# EAGLE design AbbotCameraController (EAGLE 6.5.0)
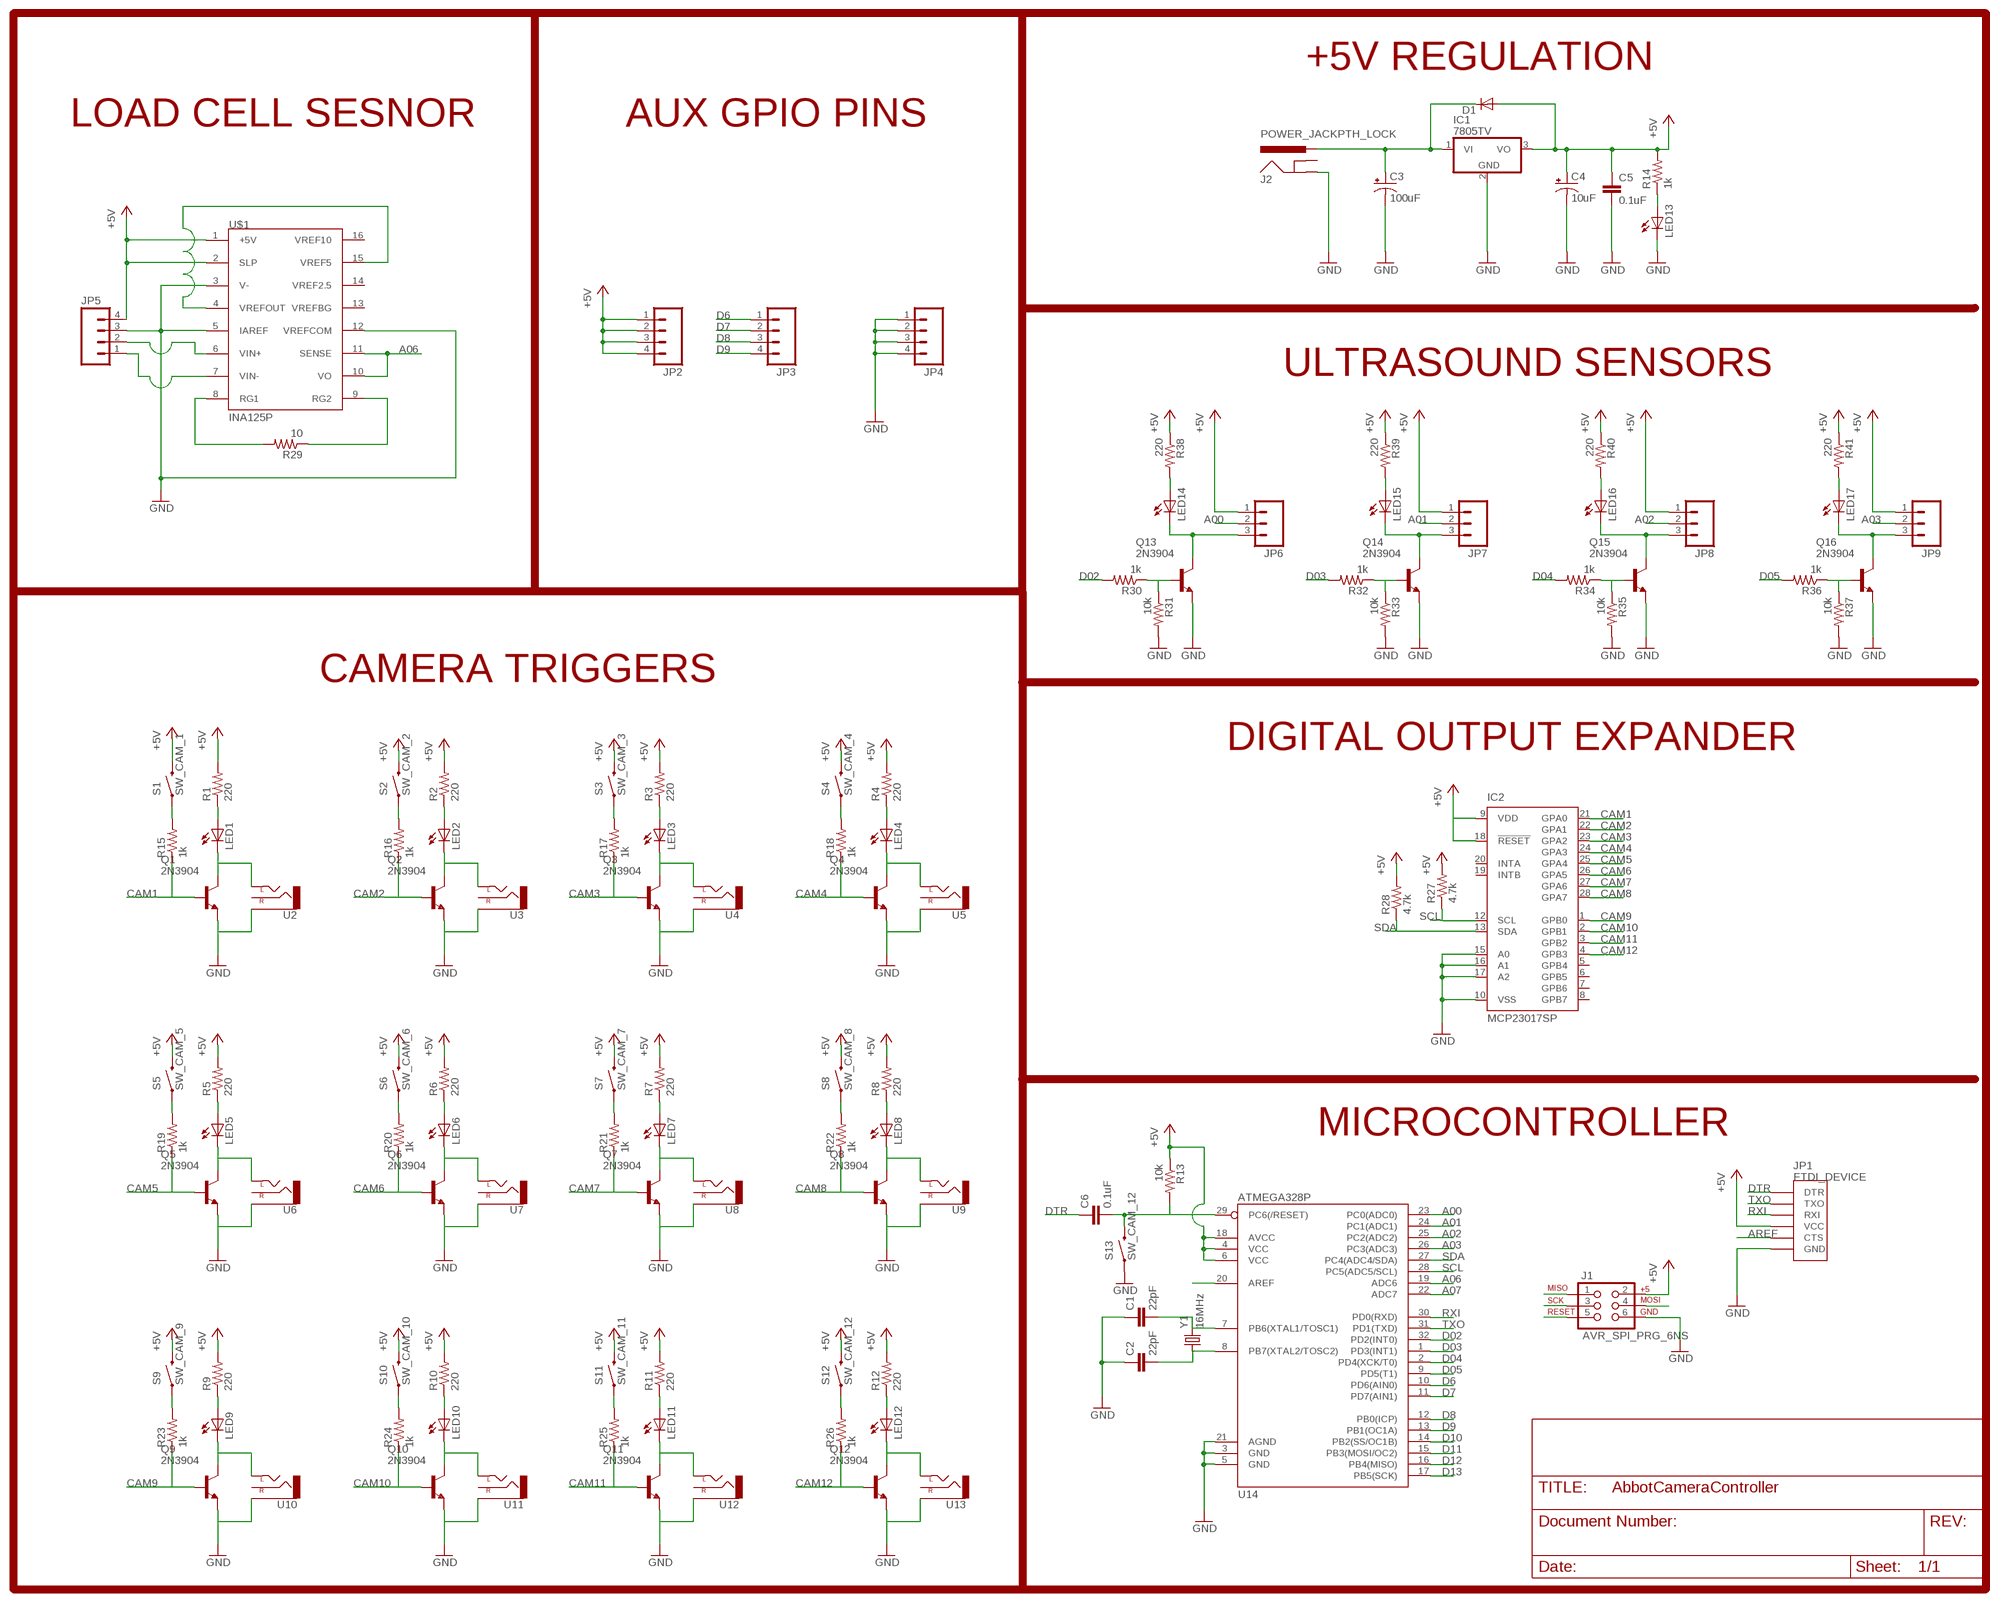
[diagram p0: schematic, sheet 1]

## Parts
C1  22pF  CAPPTH2  [CAP-PTH-SMALL2]
C2  22pF  CAPPTH2  [CAP-PTH-SMALL2]
C3  100uF  CPOL-USE2.5-7  [E2,5-7]
C4  10uF  CPOL-USE2.5-5  [E2,5-5]
C5  0.1uF  C-EU025-025X050  [C025-025X050]
C6  0.1uF  C-EU025-025X050  [C025-025X050]
D1  DIODEPTH  [DIODE-1N4001]
IC1  7805TV  [TO220V]
IC2  MCP23017SP  [DIL28-3]
J1  AVR_SPI_PRG_6NS  [2X3-NS]
J2  POWER_JACKPTH_LOCK  [POWER_JACK_PTH_LOCK]
JP1  FTDI_DEVICE  [FTDI_DEVICE_SIDE]
JP2  M04PTH  [1X04]
JP3  M04PTH  [1X04]
JP4  M04PTH  [1X04]
JP5  M04LONGPADS  [1X04_LONGPADS]
JP6  M03LONGPADS  [1X03_LONGPADS]
JP7  M03LONGPADS  [1X03_LONGPADS]
JP8  M03LONGPADS  [1X03_LONGPADS]
JP9  M03LONGPADS  [1X03_LONGPADS]
LED1  LED5MM  [LED5MM]
LED2  LED5MM  [LED5MM]
LED3  LED5MM  [LED5MM]
LED4  LED5MM  [LED5MM]
LED5  LED5MM  [LED5MM]
LED6  LED5MM  [LED5MM]
LED7  LED5MM  [LED5MM]
LED8  LED5MM  [LED5MM]
LED9  LED5MM  [LED5MM]
LED10  LED5MM  [LED5MM]
LED11  LED5MM  [LED5MM]
LED12  LED5MM  [LED5MM]
LED13  LED5MM  [LED5MM]
LED14  LED5MM  [LED5MM]
LED15  LED5MM  [LED5MM]
LED16  LED5MM  [LED5MM]
LED17  LED5MM  [LED5MM]
Q1  2N3904  [TO92]
Q2  2N3904  [TO92]
Q3  2N3904  [TO92]
Q4  2N3904  [TO92]
Q5  2N3904  [TO92]
Q6  2N3904  [TO92]
Q7  2N3904  [TO92]
Q8  2N3904  [TO92]
Q9  2N3904  [TO92]
Q10  2N3904  [TO92]
Q11  2N3904  [TO92]
Q12  2N3904  [TO92]
Q13  2N3904  [TO92]
Q14  2N3904  [TO92]
Q15  2N3904  [TO92]
Q16  2N3904  [TO92]
R1  220  R-US_0207/10  [0207/10]
R2  220  R-US_0207/10  [0207/10]
R3  220  R-US_0207/10  [0207/10]
R4  220  R-US_0207/10  [0207/10]
R5  220  R-US_0207/10  [0207/10]
R6  220  R-US_0207/10  [0207/10]
R7  220  R-US_0207/10  [0207/10]
R8  220  R-US_0207/10  [0207/10]
R9  220  R-US_0207/10  [0207/10]
R10  220  R-US_0207/10  [0207/10]
R11  220  R-US_0207/10  [0207/10]
R12  220  R-US_0207/10  [0207/10]
R13  10k  R-US_0207/10  [0207/10]
R14  1k  R-US_0207/10  [0207/10]
R15  1k  R-US_0207/10  [0207/10]
R16  1k  R-US_0207/10  [0207/10]
R17  1k  R-US_0207/10  [0207/10]
R18  1k  R-US_0207/10  [0207/10]
R19  1k  R-US_0207/10  [0207/10]
R20  1k  R-US_0207/10  [0207/10]
R21  1k  R-US_0207/10  [0207/10]
R22  1k  R-US_0207/10  [0207/10]
R23  1k  R-US_0207/10  [0207/10]
R24  1k  R-US_0207/10  [0207/10]
R25  1k  R-US_0207/10  [0207/10]
R26  1k  R-US_0207/10  [0207/10]
R27  4.7k  R-US_0207/10  [0207/10]
R28  4.7k  R-US_0207/10  [0207/10]
R29  10  R-US_0207/10  [0207/10]
R30  1k  R-US_0207/10  [0207/10]
R31  10k  R-US_0207/10  [0207/10]
R32  1k  R-US_0207/10  [0207/10]
R33  10k  R-US_0207/10  [0207/10]
R34  1k  R-US_0207/10  [0207/10]
R35  10k  R-US_0207/10  [0207/10]
R36  1k  R-US_0207/10  [0207/10]
R37  10k  R-US_0207/10  [0207/10]
R38  220  R-US_0207/10  [0207/10]
R39  220  R-US_0207/10  [0207/10]
R40  220  R-US_0207/10  [0207/10]
R41  220  R-US_0207/10  [0207/10]
S1  SW_CAM_1  SWITCH-MOMENTARY-2PTH  [TACTILE-PTH]
S2  SW_CAM_2  SWITCH-MOMENTARY-2PTH  [TACTILE-PTH]
S3  SW_CAM_3  SWITCH-MOMENTARY-2PTH  [TACTILE-PTH]
S4  SW_CAM_4  SWITCH-MOMENTARY-2PTH  [TACTILE-PTH]
S5  SW_CAM_5  SWITCH-MOMENTARY-2PTH  [TACTILE-PTH]
S6  SW_CAM_6  SWITCH-MOMENTARY-2PTH  [TACTILE-PTH]
S7  SW_CAM_7  SWITCH-MOMENTARY-2PTH  [TACTILE-PTH]
S8  SW_CAM_8  SWITCH-MOMENTARY-2PTH  [TACTILE-PTH]
S9  SW_CAM_9  SWITCH-MOMENTARY-2PTH  [TACTILE-PTH]
S10  SW_CAM_10  SWITCH-MOMENTARY-2PTH  [TACTILE-PTH]
S11  SW_CAM_11  SWITCH-MOMENTARY-2PTH  [TACTILE-PTH]
S12  SW_CAM_12  SWITCH-MOMENTARY-2PTH  [TACTILE-PTH]
S13  SW_CAM_12  SWITCH-MOMENTARY-2PTH  [TACTILE-PTH]
U2  AUDIO-JACKSPECIAL_POGO_PINS  [STEREOJACK2.5MM_SPECIA_POGOPINS]
U3  AUDIO-JACKSPECIAL_POGO_PINS  [STEREOJACK2.5MM_SPECIA_POGOPINS]
U4  AUDIO-JACKSPECIAL_POGO_PINS  [STEREOJACK2.5MM_SPECIA_POGOPINS]
U5  AUDIO-JACKSPECIAL_POGO_PINS  [STEREOJACK2.5MM_SPECIA_POGOPINS]
U6  AUDIO-JACKSPECIAL_POGO_PINS  [STEREOJACK2.5MM_SPECIA_POGOPINS]
U7  AUDIO-JACKSPECIAL_POGO_PINS  [STEREOJACK2.5MM_SPECIA_POGOPINS]
U8  AUDIO-JACKSPECIAL_POGO_PINS  [STEREOJACK2.5MM_SPECIA_POGOPINS]
U9  AUDIO-JACKSPECIAL_POGO_PINS  [STEREOJACK2.5MM_SPECIA_POGOPINS]
U10  AUDIO-JACKSPECIAL_POGO_PINS  [STEREOJACK2.5MM_SPECIA_POGOPINS]
U11  AUDIO-JACKSPECIAL_POGO_PINS  [STEREOJACK2.5MM_SPECIA_POGOPINS]
U12  AUDIO-JACKSPECIAL_POGO_PINS  [STEREOJACK2.5MM_SPECIA_POGOPINS]
U13  AUDIO-JACKSPECIAL_POGO_PINS  [STEREOJACK2.5MM_SPECIA_POGOPINS]
U14  ATMEGA328P  ATMEGA328_SMT  [TQFP32-08]
U$1  INA125P  [16-DIP]
Y1  16MHz  CRYSTALHC49US  [HC49US]

## Nets
+5V: C4.+ C5.1 D1.A IC1.3(VO) IC2.9(VDD) IC2.18(!RESET) J1.2 JP1.P$4(VCC) JP2.1 JP2.2 JP2.3 JP2.4 JP5.4 JP6.1 JP7.1 JP8.1 JP9.1 R1.2 R2.2 R3.2 R4.2 R5.2 R6.2 R7.2 R8.2 R9.2 R10.2 R11.2 R12.2 R13.1 R14.2 R27.2 R28.2 R38.1 R39.1 R40.1 R41.1 S1.3 S2.3 S3.3 S4.3 S5.3 S6.3 S7.3 S8.3 S9.3 S10.3 S11.3 S12.3 U14.4(VCC) U14.6(VCC) U14.18(AVCC) U$1.1(+5V) U$1.2(SLP)
A00: JP6.2 U14.23(PC0(ADC0))
A01: JP7.2 U14.24(PC1(ADC1))
A02: JP8.2 U14.25(PC2(ADC2))
A03: JP9.2 U14.26(PC3(ADC3))
A06: U14.19(ADC6) U$1.10(VO) U$1.11(SENSE)
A07: U14.22(ADC7)
AREF: JP1.P$5(CTS) U14.20(AREF)
CAM1: IC2.21(GPA0) Q1.2(B) R15.1
CAM2: IC2.22(GPA1) Q2.2(B) R16.1
CAM3: IC2.23(GPA2) Q3.2(B) R17.1
CAM4: IC2.24(GPA3) Q4.2(B) R18.1
CAM5: IC2.25(GPA4) Q5.2(B) R19.1
CAM6: IC2.26(GPA5) Q6.2(B) R20.1
CAM7: IC2.27(GPA6) Q7.2(B) R21.1
CAM8: IC2.28(GPA7) Q8.2(B) R22.1
CAM9: IC2.1(GPB0) Q9.2(B) R23.1
CAM10: IC2.2(GPB1) Q10.2(B) R24.1
CAM11: IC2.3(GPB2) Q11.2(B) R25.1
CAM12: IC2.4(GPB3) Q12.2(B) R26.1
D02: R30.2 U14.32(PD2(INT0))
D03: R32.2 U14.1(PD3(INT1))
D04: R34.2 U14.2(PD4(XCK/T0))
D05: R36.2 U14.9(PD5(T1))
D6: JP3.1 U14.10(PD6(AIN0))
D7: JP3.2 U14.11(PD7(AIN1))
D8: JP3.3 U14.12(PB0(ICP))
D9: JP3.4 U14.13(PB1(OC1A))
D10: U14.14(PB2(SS/OC1B))
D11: J1.4 U14.15(PB3(MOSI/OC2))
D12: J1.1 U14.16(PB4(MISO))
D13: J1.3 U14.17(PB5(SCK))
DTR: C6.1 JP1.P$1(DTR)
GND: C1.1 C2.1 C3.- C4.- C5.2 IC1.2(GND) IC2.10(VSS) IC2.15(A0) IC2.16(A1) IC2.17(A2) J1.6 J2.GND JP1.P$6(GND) JP4.1 JP4.2 JP4.3 JP4.4 JP5.3 LED13.K(C) Q1.3(E) Q2.3(E) Q3.3(E) Q4.3(E) Q5.3(E) Q6.3(E) Q7.3(E) Q8.3(E) Q9.3(E) Q10.3(E) Q11.3(E) Q12.3(E) Q13.3(E) Q14.3(E) Q15.3(E) Q16.3(E) R31.2 R33.2 R35.2 R37.2 S13.1 U2.RING1(SLEEVE) U3.RING1(SLEEVE) U4.RING1(SLEEVE) U5.RING1(SLEEVE) U6.RING1(SLEEVE) U7.RING1(SLEEVE) U8.RING1(SLEEVE) U9.RING1(SLEEVE) U10.RING1(SLEEVE) U11.RING1(SLEEVE) U12.RING1(SLEEVE) U13.RING1(SLEEVE) U14.3(GND) U14.5(GND) U14.21(AGND) U$1.3(V-) U$1.5(IAREF) U$1.12(VREFCOM)
N$1: LED1.K(C) Q1.1(C) U2.SHIELD(LEFT)
N$2: LED1.A R1.1
N$3: LED2.K(C) Q2.1(C) U3.SHIELD(LEFT)
N$4: LED2.A R2.1
N$5: LED3.K(C) Q3.1(C) U4.SHIELD(LEFT)
N$6: LED3.A R3.1
N$7: LED4.K(C) Q4.1(C) U5.SHIELD(LEFT)
N$8: LED4.A R4.1
N$9: LED5.K(C) Q5.1(C) U6.SHIELD(LEFT)
N$10: LED5.A R5.1
N$11: LED6.K(C) Q6.1(C) U7.SHIELD(LEFT)
N$12: LED6.A R6.1
N$13: LED7.K(C) Q7.1(C) U8.SHIELD(LEFT)
N$14: LED7.A R7.1
N$15: LED8.K(C) Q8.1(C) U9.SHIELD(LEFT)
N$16: LED8.A R8.1
N$17: LED9.K(C) Q9.1(C) U10.SHIELD(LEFT)
N$18: LED9.A R9.1
N$19: LED10.K(C) Q10.1(C) U11.SHIELD(LEFT)
N$20: LED10.A R10.1
N$21: LED11.K(C) Q11.1(C) U12.SHIELD(LEFT)
N$22: LED11.A R11.1
N$23: LED12.K(C) Q12.1(C) U13.SHIELD(LEFT)
N$24: LED12.A R12.1
N$25: Q13.2(B) R30.1 R31.1
N$26: C3.+ D1.C IC1.1(VI) J2.PWR
N$27: Q14.2(B) R32.1 R33.1
N$28: JP6.3 LED14.K(C) Q13.1(C)
N$29: JP7.3 LED15.K(C) Q14.1(C)
N$30: C1.2 U14.7(PB6(XTAL1/TOSC1)) Y1.2
N$31: C2.2 U14.8(PB7(XTAL2/TOSC2)) Y1.1
N$32: LED13.A R14.1
N$33: JP5.2 U$1.6(VIN+)
N$34: R29.2 U$1.8(RG1)
N$35: R15.2 S1.1
N$36: R16.2 S2.1
N$41: R17.2 S3.1
N$42: R18.2 S4.1
N$43: R19.2 S5.1
N$44: R20.2 S6.1
N$45: R21.2 S7.1
N$46: R22.2 S8.1
N$47: R23.2 S9.1
N$48: R24.2 S10.1
N$49: R25.2 S11.1
N$50: R26.2 S12.1
N$51: U$1.4(VREFOUT) U$1.15(VREF5)
N$52: JP5.1 U$1.7(VIN-)
N$53: R29.1 U$1.9(RG2)
N$54: Q15.2(B) R34.1 R35.1
N$55: JP8.3 LED16.K(C) Q15.1(C)
N$56: Q16.2(B) R36.1 R37.1
N$57: JP9.3 LED17.K(C) Q16.1(C)
N$58: LED14.A R38.2
N$59: LED15.A R39.2
N$60: LED16.A R40.2
N$62: LED17.A R41.2
RST: C6.2 J1.5 R13.2 S13.3 U14.29(PC6(/RESET))
RXI: JP1.P$3(RXI) U14.30(PD0(RXD))
SCL: IC2.12(SCL) R27.1 U14.28(PC5(ADC5/SCL))
SDA: IC2.13(SDA) R28.1 U14.27(PC4(ADC4/SDA))
TXO: JP1.P$2(TXO) U14.31(PD1(TXD))
Unconnected: IC2.5(GPB4) IC2.6(GPB5) IC2.7(GPB6) IC2.8(GPB7) IC2.19(INTB) IC2.20(INTA) J2.GNDBREAK U2.TIP(RIGHT) U3.TIP(RIGHT) U4.TIP(RIGHT) U5.TIP(RIGHT) U6.TIP(RIGHT) U7.TIP(RIGHT) U8.TIP(RIGHT) U9.TIP(RIGHT) U10.TIP(RIGHT) U11.TIP(RIGHT) U12.TIP(RIGHT) U13.TIP(RIGHT) U$1.13(VREFBG) U$1.14(VREF2.5) U$1.16(VREF10)

## Notes on the sheet
- +5V REGULATION
- LOAD CELL SESNOR | AUX GPIO PINS
- ULTRASOUND SENSORS
- CAMERA TRIGGERS
- DIGITAL OUTPUT EXPANDER
- MICROCONTROLLER

## Library data of the parts
C1 C2 = SparkFun-Passives:CAP: Capacitor Standard 0603 ceramic capacitor, and 0.1" leaded capacitor.
C3 C4 = rcl:CPOL-US: POLARIZED CAPACITOR, American symbol
C5 C6 = rcl:C-EU: CAPACITOR, European symbol
D1 = SparkFun-DiscreteSemi:DIODE: Diode These are standard reverse protection diodes and small signal diodes. SMA package can handle up to about 1A. SOD-323 can handle about 200mA. What the SOD-323 package when ordering, there are some mfgs out there that are 5-pin packages.
IC1 = linear:78*: Positive VOLTAGE REGULATOR Source: http://cache.national.com/ds/LM/LM78L05.pdf http://www.fairchildsemi.com/ds/LM/LM7805.pdf
IC2 = adafruit:MCP23017: http://ww1.microchip.com/downloads/en/DeviceDoc/21952a.pdf Source: http://ww1.microchip.com/downloads/en/DeviceDoc/21952a.pdf
J1 = SparkFun-Connectors:AVR_SPI_PRG_6: AVR ISP 6 Pin This is the reduced ISP connector for AVR programming. Common on Arduino. This footprint will take up less PCB space and can be used with a 10-pin to 6-pin adapter such as SKU: BOB-08508
J2 = SparkFun-Connectors:POWER_JACK: Power Jack This is the standard 5.5mm barrel jack for power. The PTH is the most common, proven, reliable, footprint. The Slot footprint only works if the mill layer is transmitted to the PCB fab house so be warned. Spark Fun Electronics SKU : PRT-00119 SMT: CONN-08106 Mating wall wart : TOL-00298 (and others)
JP1 = SparkFun-Connectors:FTDI_DEVICE: Connector which mates to FTDI basic or FTDI cable.
JP2-JP5 = SparkFun-Connectors:M04: Header 4 Standard 4-pin 0.1" header. Use with straight break away headers (SKU : PRT-00116), right angle break away headers (PRT-00553), swiss pins (PRT-00743), machine pins (PRT-00117), and female headers (PRT-00115). Molex polarized connector foot print use with SKU : PRT-08231 with associated crimp pins and housings. 1MM SMD Version SKU: PRT-10208
JP6-JP9 = SparkFun-Connectors:M03: Header 3 Standard 3-pin 0.1" header. Use with straight break away headers (SKU : PRT-00116), right angle break away headers (PRT-00553), swiss pins (PRT-00743), machine pins (PRT-00117), and female headers (PRT-00115). Molex polarized connector foot print use with SKU : PRT-08232 with associated crimp pins and housings.
LED1-LED17 = SparkFun-LED:LED: LEDs Standard schematic elements and footprints for 5mm, 3mm, 1206, and 0603 sized LEDs. 5mm - Spark Fun Electronics SKU : COM-00529 (and others)
Q1-Q16 = transistor-npn:2N3904: NPN Transistor
R1-R41 = rcl:R-US_: RESISTOR, American symbol
S1-S13 = SparkFun-Electromechanical:SWITCH-MOMENTARY-2: Various NO switches- pushbuttons, reed, etc
U2-U13 = SparkFun-Connectors:AUDIO-JACK: 3.5mm Audio Jack Simple 3.5mm common PCB mount audio jack. SKU: PRT-08032
U14 = SparkFun-DigitalIC:ATMEGA328_SMT: 32-Pin Atmega328 part Commonly used on Arduino compatible boards Available in QFP and QFN packages TQFP is IC-09069 QFN is non-stock; PROD_ID: IC-09069
U$1 = EzerLonginus:INA125P
Y1 = SparkFun-FreqCtrl:CRYSTAL: Various standard crystals. Proven footprints. Spark Fun Electronics SKU : COM-00534

## Board
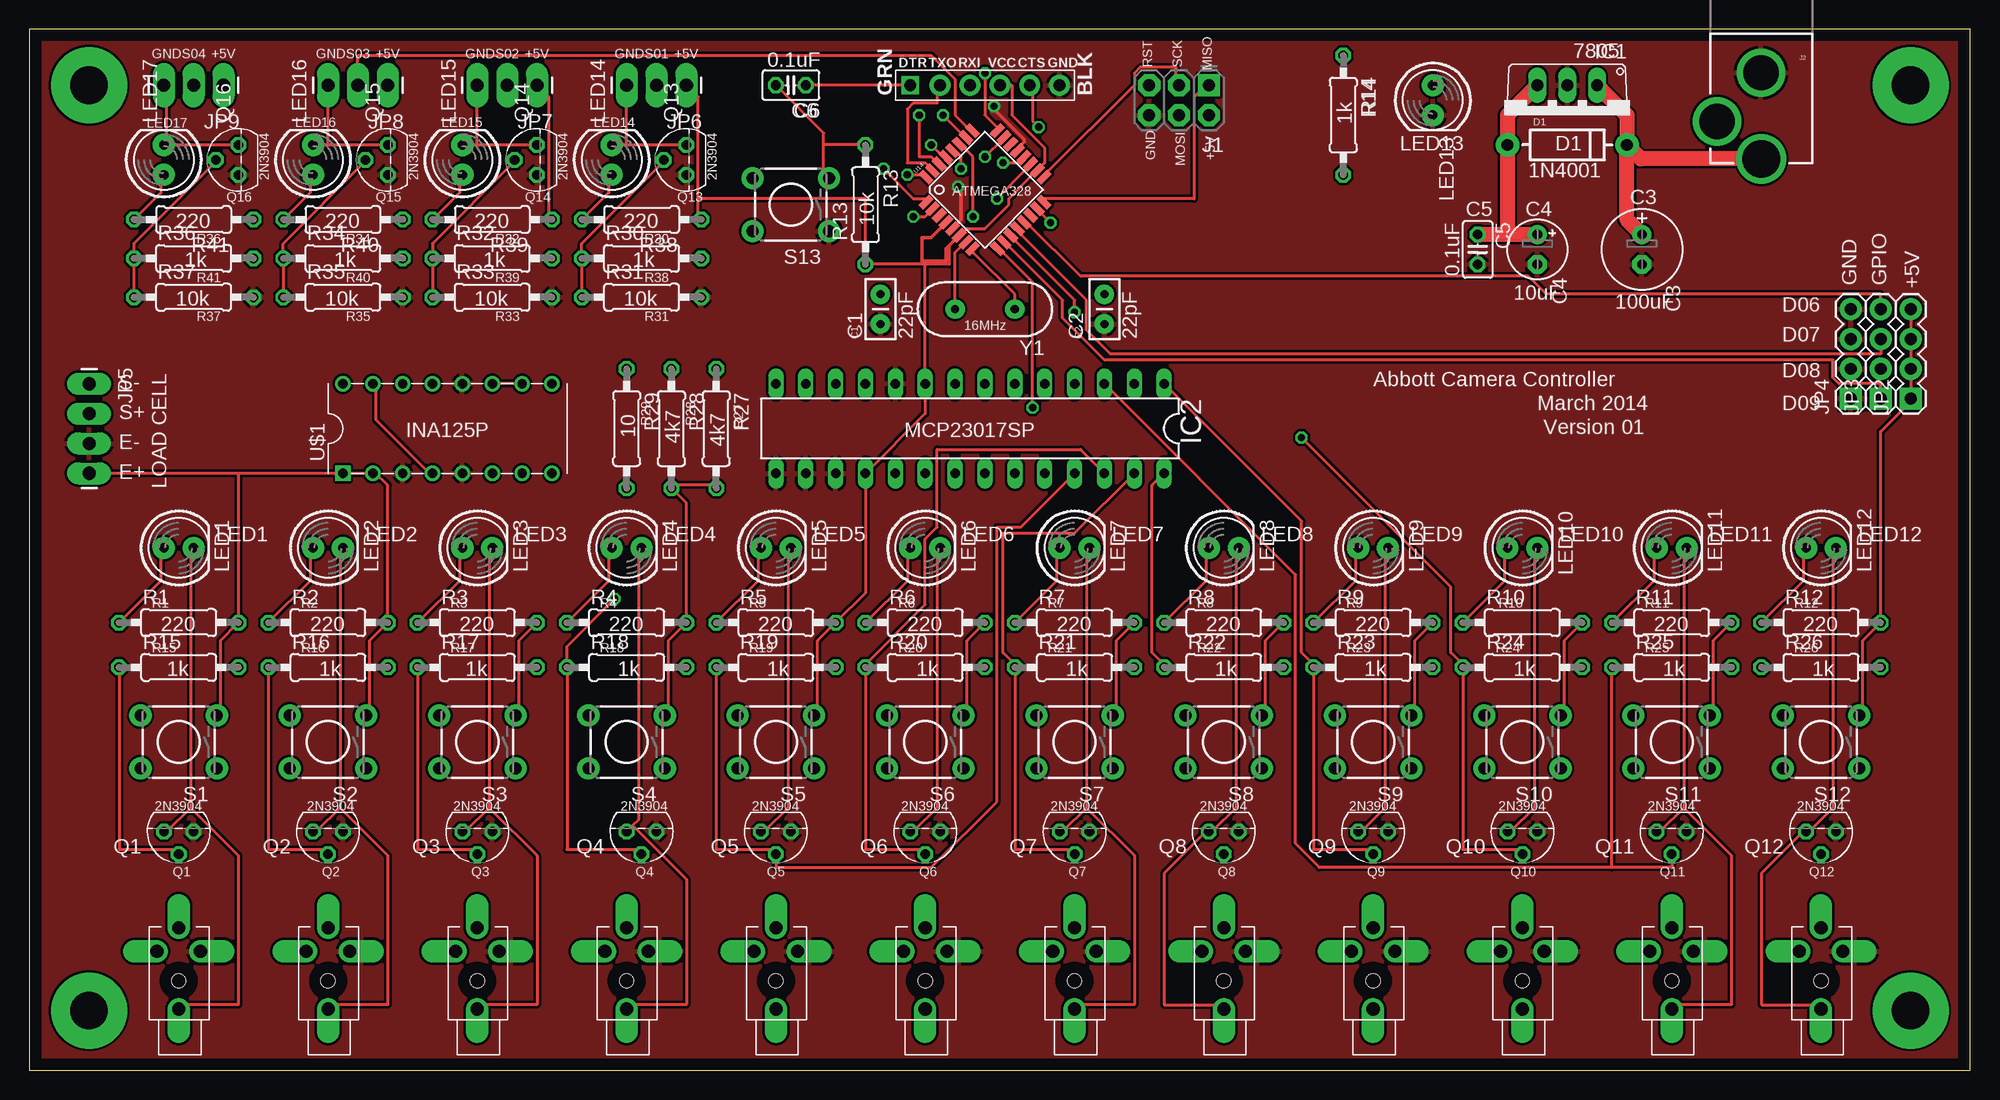
[diagram p1: board, top side]
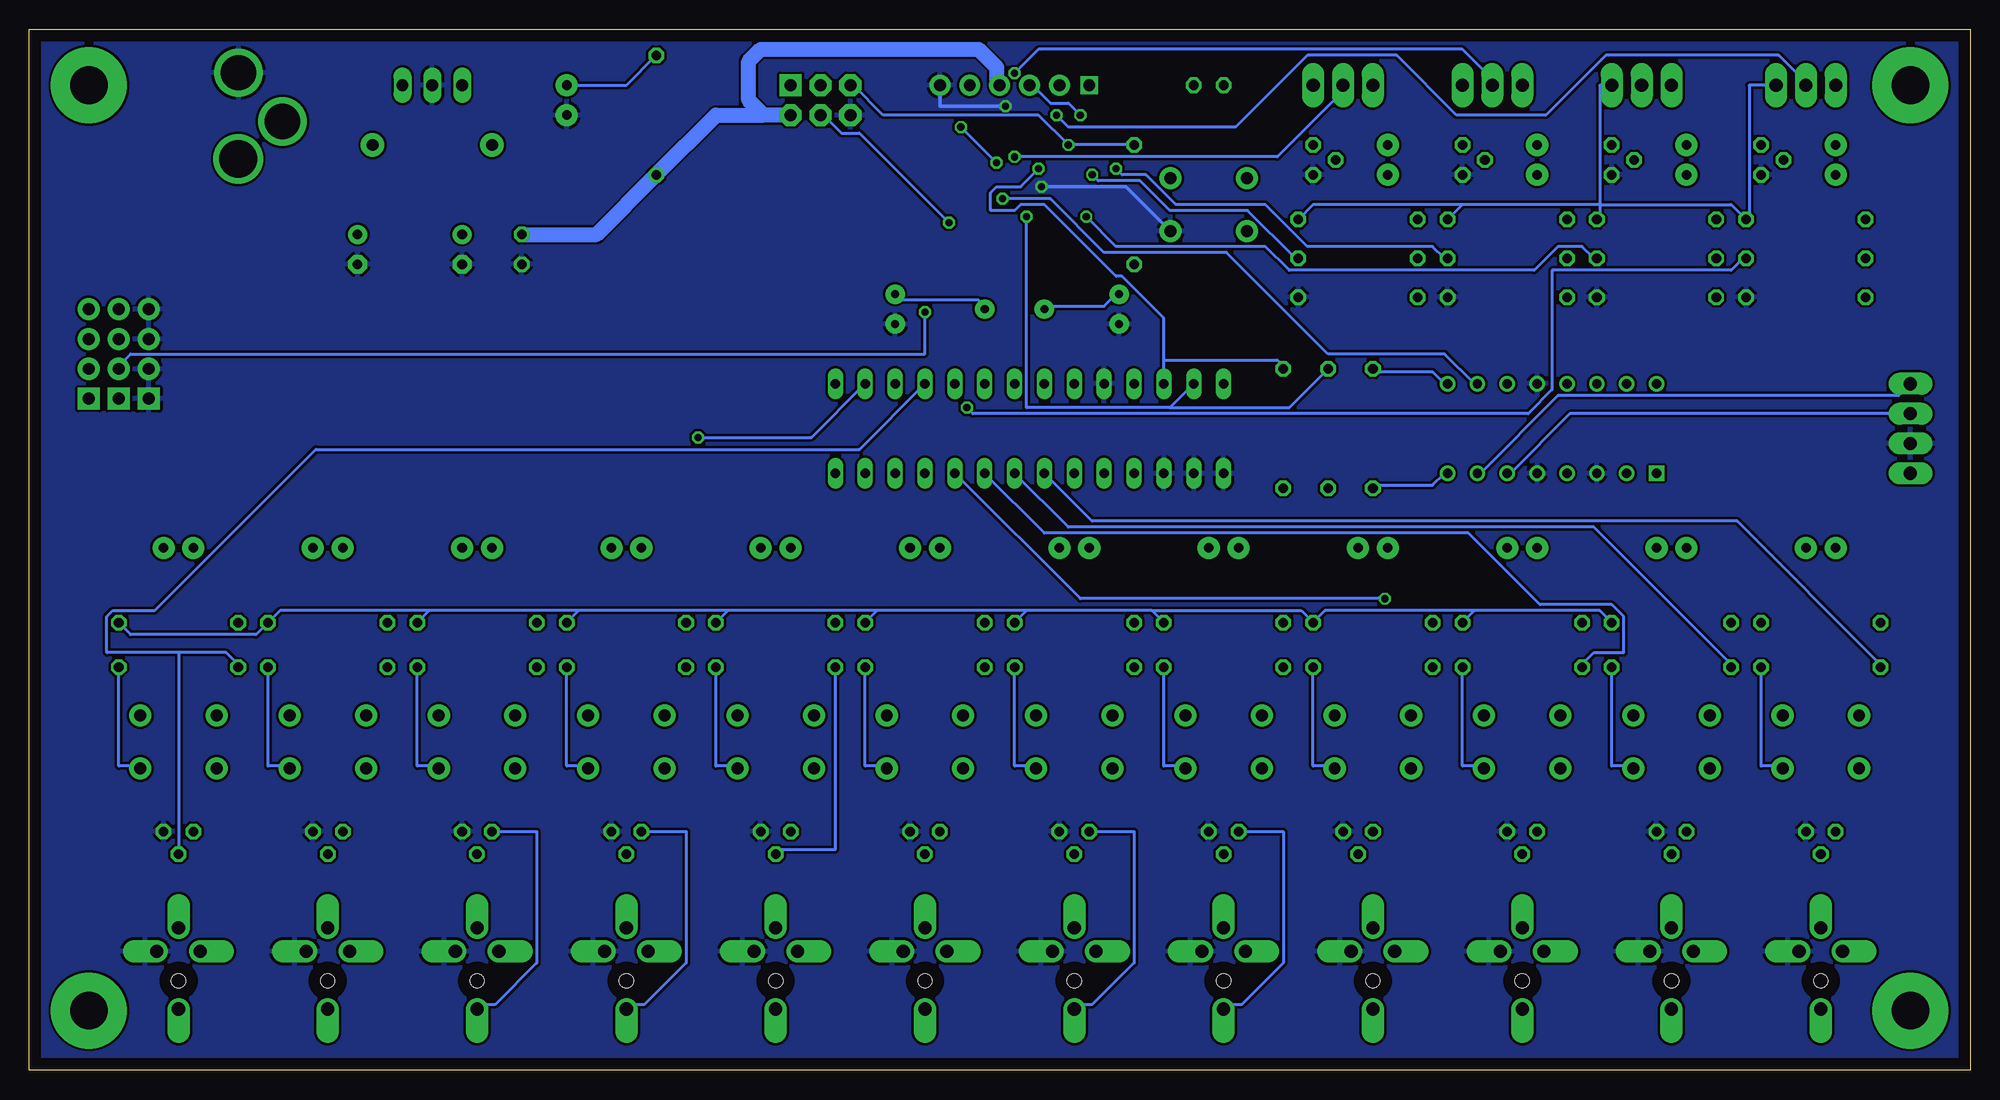
[diagram p2: board, bottom side, seen from below]

Size 165.08 x 88.57 mm. Coordinates in mm from the lower left corner, seen from the top.
Outline: 0,0 165.08,0 165.08,88.57 0,88.57 0,0
Copper layers (1*16): Top 0.035mm / dielectric 1.5mm / Bottom 0.035mm
Design rules "default": minimum track width 10mil, minimum drill 24mil, track to track 8mil, track to pad 8mil, pad to pad 8mil, via to via 8mil, smd to smd 8mil, copper to edge 40mil, drill to drill 8mil, minimum pad ring 10mil, minimum via ring 8mil, stop-mask expansion 4mil, vias tented up to drill 0mil, thermal gap 10mil

### Footprints (pad centres in the part's own frame; a part is rotated, then mirrored left to right if it is on the bottom)
CAP-PTH-SMALL2 = drill 0.7 pad 1.651: 1 0,0; 2 2.54,0
E2,5-7 = drill 0.813 pad 1.6: + -1.27,0 | drill 0.813 pad 1.6 octagon: - 1.27,0
E2,5-5 = drill 0.813 pad 1.6: + -1.27,0 | drill 0.813 pad 1.6 octagon: - 1.27,0
C025-025X050 = drill 0.813 octagon: 1 -1.27,0; 2 1.27,0
DIODE-1N4001 = drill 1 pad 1.981: A -5.08,0; C 5.08,0
TO220V = drill 1.016 long: 1 -2.54,-2.54; 2 0,-2.54; 3 2.54,-2.54
DIL28-3 = drill 0.813 long: 1 -16.51,-3.81; 2 -13.97,-3.81; 3 -11.43,-3.81; 4 -8.89,-3.81; 5 -6.35,-3.81; 6 -3.81,-3.81; 7 -1.27,-3.81; 8 1.27,-3.81; 9 3.81,-3.81; 10 6.35,-3.81; 11 8.89,-3.81; 12 11.43,-3.81; 13 13.97,-3.81; 14 16.51,-3.81; 15 16.51,3.81; 16 13.97,3.81; 17 11.43,3.81; 18 8.89,3.81; 19 6.35,3.81; 20 3.81,3.81; 21 1.27,3.81; 22 -1.27,3.81; 23 -3.81,3.81; 24 -6.35,3.81; 25 -8.89,3.81; 26 -11.43,3.81; 27 -13.97,3.81; 28 -16.51,3.81
2X3-NS = drill 1.016 pad 1.88 square: 1 -2.54,-1.27 | drill 1.016 pad 1.88 octagon: 2 -2.54,1.27; 3 0,-1.27; 4 0,1.27; 5 2.54,-1.27; 6 2.54,1.27
POWER_JACK_PTH_LOCK = drill 2.997 pad 4.115: GND 0.025,6.557; GNDBREAK 3.762,10.7 | drill 3.2 pad 4.115: PWR 0,13.878
FTDI_DEVICE_SIDE = drill 1 square: P$1 -6.35,0 | drill 1.016 pad 1.778: P$2 -3.81,0; P$3 -1.27,0; P$4 1.27,0; P$5 3.81,0; P$6 6.35,0
1X04 = drill 1.016 pad 1.88 square: 1 0,0 | drill 1.016 pad 1.88: 2 2.54,0; 3 5.08,0; 4 7.62,0
1X04_LONGPADS = drill 1.118 pad 1.88 long: 1 0,0; 2 2.54,0; 3 5.08,0; 4 7.62,0
1X03_LONGPADS = drill 1.118 pad 1.88 long: 1 0,0; 2 2.54,0; 3 5.08,0
LED5MM = drill 0.813 pad 1.88: A -1.27,0; K 1.27,0
TO92 = drill 0.813 octagon: 1 1.27,0; 2 0,1.905; 3 -1.27,0
0207/10 = drill 0.813 octagon: 1 -5.08,0; 2 5.08,0
TACTILE-PTH = drill 1.016 pad 1.88: 1 -3.251,2.261; 2 3.251,2.261; 3 -3.251,-2.261; 4 3.251,-2.261
STEREOJACK2.5MM_SPECIA_POGOPINS = drill 1.118 pad 1.93 offset: RING1 2.5,-1.85; RING2 2.5,1.85; SHIELD -2.4,0; TIP 4.5,0 | hole 1.2: 0,0
TQFP32-08 = smd 1.27 x 0.559: 1 -4.293,2.8; 2 -4.293,2; 3 -4.293,1.2; 4 -4.293,0.4; 5 -4.293,-0.4; 6 -4.293,-1.2; 7 -4.293,-2; 8 -4.293,-2.8; 17 4.293,-2.8; 18 4.293,-2; 19 4.293,-1.2; 20 4.293,-0.4; 21 4.293,0.4; 22 4.293,1.2; 23 4.293,2; 24 4.293,2.8 | smd 0.559 x 1.27: 9 -2.8,-4.293; 10 -2,-4.293; 11 -1.2,-4.293; 12 -0.4,-4.293; 13 0.4,-4.293; 14 1.2,-4.293; 15 2,-4.293; 16 2.8,-4.293; 25 2.8,4.293; 26 2,4.293; 27 1.2,4.293; 28 0.4,4.293; 29 -0.4,4.293; 30 -1.2,4.293; 31 -2,4.293; 32 -2.8,4.293
16-DIP = drill 0.8 square: 1 -3.81,8.89 | drill 0.8: 2 -3.81,6.35; 3 -3.81,3.81; 4 -3.81,1.27; 5 -3.81,-1.27; 6 -3.81,-3.81; 7 -3.81,-6.35; 8 -3.81,-8.89; 9 3.81,-8.89; 10 3.81,-6.35; 11 3.81,-3.81; 12 3.81,-1.27; 13 3.81,1.27; 14 3.81,3.81; 15 3.81,6.35; 16 3.81,8.89
HC49US = drill 0.7 pad 1.651: 1 -2.54,0; 2 2.54,0

### Placement (x,y rotation side)
C1  72.39,63.5 90 top
C2  91.44,63.5 90 top
C3  137.16,69.85 270 top
C4  128.27,69.85 270 top
C5  123.19,69.85 270 top
C6  64.77,83.82 180 top
D1  130.81,78.74 0 top
IC1  130.81,81.28 180 top
IC2  80.01,54.61 180 top
J1  97.79,82.55 180 top
J2  147.32,91.44 180 top
JP1  81.28,83.82 0 top
JP2  160.02,57.15 90 top
JP3  157.48,57.15 90 top
JP4  154.94,57.15 90 top
JP5  5.08,58.42 270 top
JP6  55.88,83.82 180 top
JP7  43.18,83.82 180 top
JP8  30.48,83.82 180 top
JP9  16.51,83.82 180 top
LED1  12.7,44.45 0 top
LED2  25.4,44.45 0 top
LED3  38.1,44.45 0 top
LED4  50.8,44.45 0 top
LED5  63.5,44.45 0 top
LED6  76.2,44.45 0 top
LED7  88.9,44.45 0 top
LED8  101.6,44.45 0 top
LED9  114.3,44.45 0 top
LED10  127,44.45 0 top
LED11  139.7,44.45 0 top
LED12  152.4,44.45 0 top
LED13  119.38,82.55 270 top
LED14  49.53,77.47 90 top
LED15  36.83,77.47 90 top
LED16  24.13,77.47 90 top
LED17  11.43,77.47 90 top
Q1  12.7,20.32 180 top
Q2  25.4,20.32 180 top
Q3  38.1,20.32 180 top
Q4  52.07,20.32 180 top
Q5  63.5,20.32 180 top
Q6  76.2,20.32 180 top
Q7  88.9,20.32 180 top
Q8  101.6,20.32 180 top
Q9  114.3,20.32 180 top
Q10  127,20.32 180 top
Q11  139.7,20.32 180 top
Q12  152.4,20.32 180 top
Q13  55.88,77.47 90 top
Q14  43.18,77.47 90 top
Q15  30.48,77.47 90 top
Q16  17.78,77.47 90 top
R1  12.7,38.1 0 top
R2  25.4,38.1 0 top
R3  38.1,38.1 0 top
R4  50.8,38.1 0 top
R5  63.5,38.1 0 top
R6  76.2,38.1 0 top
R7  88.9,38.1 0 top
R8  101.6,38.1 0 top
R9  114.3,38.1 0 top
R10  127,38.1 0 top
R11  139.7,38.1 0 top
R12  152.4,38.1 0 top
R13  71.12,73.66 90 top
R14  111.76,81.28 270 top
R15  12.7,34.29 0 top
R16  25.4,34.29 0 top
R17  38.1,34.29 0 top
R18  50.8,34.29 0 top
R19  63.5,34.29 0 top
R20  76.2,34.29 0 top
R21  88.9,34.29 0 top
R22  101.6,34.29 0 top
R23  114.3,34.29 0 top
R24  127,34.29 0 top
R25  139.7,34.29 0 top
R26  152.4,34.29 0 top
R27  58.42,54.61 270 top
R28  54.61,54.61 270 top
R29  50.8,54.61 270 top
R30  52.07,69.09 0 top
R31  52.07,65.79 0 top
R32  39.37,69.09 0 top
R33  39.37,65.79 0 top
R34  26.67,69.09 0 top
R35  26.67,65.79 0 top
R36  13.97,69.09 0 top
R37  13.97,65.79 0 top
R38  52.07,72.39 180 top
R39  39.37,72.39 180 top
R40  26.67,72.39 180 top
R41  13.97,72.39 180 top
S1  12.7,27.94 180 top
S2  25.4,27.94 180 top
S3  38.1,27.94 180 top
S4  50.8,27.94 180 top
S5  63.5,27.94 180 top
S6  76.2,27.94 180 top
S7  88.9,27.94 180 top
S8  101.6,27.94 180 top
S9  114.3,27.94 180 top
S10  127,27.94 180 top
S11  139.7,27.94 180 top
S12  152.4,27.94 180 top
S13  64.77,73.66 180 top
U2  12.7,7.62 90 top
U3  25.4,7.62 90 top
U4  38.1,7.62 90 top
U5  50.8,7.62 90 top
U6  63.5,7.62 90 top
U7  76.2,7.62 90 top
U8  88.9,7.62 90 top
U9  101.6,7.62 90 top
U10  114.3,7.62 90 top
U11  127,7.62 90 top
U12  139.7,7.62 90 top
U13  152.4,7.62 90 top
U14  81.28,74.93 45 top
U$1  35.56,54.61 90 top
Y1  81.28,64.77 180 top

### Tracks (layer width: path | path; a pad name or v marks a point on that pad's centre or on a via)
+5V
  Top 0.254: R27.2 58.42,49.78 54.86,49.78 R28.2 55.88,48.26 R4.2 54.36,36.58 54.36,30.48 S4.3 | R3.2 41.66,36.58 41.66,30.48 S3.3 | S1.3 16.26,30.48 16.26,36.58 R1.2 17.78,50.8 | S2.3 28.96,30.48 28.96,36.58 R2.2 30.48,49.78 29.46,50.8 U$1.2 U$1.1 17.78,50.8 | 17.78,50.8 JP5.4 | JP7.1 44.2,82.8 44.2,72.64 R39.1 | JP6.1 56.9,82.8 56.9,74.17 | 56.9,74.17 56.9,72.64 R38.1 | JP2.4 JP2.3 JP2.2 JP2.1 160.02,56.9 157.48,54.36 R12.2 155.96,36.58 155.96,30.48 S12.3 | R11.2 143.26,36.58 143.26,30.48 S11.3 | R10.2 130.56,36.58 130.56,30.48 S10.3 | R9.2 117.86,36.58 117.86,30.48 S9.3 | R8.2 105.16,36.58 105.16,30.48 S8.3 | R7.2 92.46,36.58 92.46,30.48 S7.3 | R6.2 79.76,36.58 79.76,30.48 S6.3 | S5.3 67.06,30.48 67.06,36.58 R5.2 71.12,40.64 IC2.18 76.2,55.88 IC2.9 76.2,68.58 | JP1.P$4 83.57,83.82 83.57,81.28 86.36,78.49 86.36,77.22 85.85,76.71 U14.18 85.34,76.2 83.31,74.17 83.31,73.66 81.28,71.63 79.76,71.63 79.25,71.12 U14.6 | 76.2,68.58 78.23,68.58 78.23,70.1 78.19,70.14 | 76.2,68.58 R13.1 71.12,74.17 56.9,74.17
  Top 0.305: U14.4 77.96,72.12 76.71,70.87 75.95,70.87 75.95,68.83 77.98,68.83 77.98,69.93 78.19,70.14 U14.6
  Top 1.27: IC1.3 125.73,81.28 D1.A 125.73,71.12 | 125.73,71.12 C5.1 | C4.+ 125.73,71.12
  Bottom 0.254: 42.16,39.12 R3.2 | 42.16,39.12 31.5,39.12 R2.2 | 42.16,39.12 54.86,39.12 R4.2 56.9,39.12 69.6,39.12 | JP9.1 18.8,83.82 18.8,72.64 R41.1 20.32,73.66 31.5,73.66 | 31.5,73.66 31.5,72.64 R40.1 | JP8.1 31.5,83.82 31.5,73.66 | 43.18,73.66 R39.1 | 31.5,73.66 43.18,73.66 | R38.1 55.88,73.66 43.18,73.66 | 80.26,39.12 R6.2 | 69.6,39.12 80.26,39.12 | R5.2 69.6,39.12 | 92.96,39.12 R7.2 | 80.26,39.12 92.96,39.12 | 105.66,39.12 R8.2 | 92.96,39.12 105.66,39.12 | 118.36,39.12 R9.2 | 105.66,39.12 118.36,39.12 | 131.06,39.12 R10.2 | 118.36,39.12 131.06,39.12 | 131.06,39.12 143.76,39.12 R11.2 145.8,37.08 156.46,37.08 R12.2
  Bottom 1.27: C5.1 116.84,71.12 R14.2 106.68,81.28 102.62,81.28 | J1.2 102.62,81.28 | 102.62,81.28 103.89,82.55 103.89,85.85 102.87,86.87 84.33,86.87 82.8,85.34 82.8,84.07 JP1.P$4
A00  (via drill 0.61)
  Top 0.254: v81.28,77.72 82.8,79.25 U14.23
  Bottom 0.254: v81.28,77.72 58.93,77.72 53.34,83.31 JP6.2
A01  (via drill 0.61)
  Top 0.254: v81.28,84.84 81.28,81.28 82.3,80.26 U14.24
  Bottom 0.254: v81.28,84.84 79.25,86.87 43.18,86.87 40.64,84.33 JP7.2
A02
  Top 0.254: JP8.2 27.94,86.36 76.71,86.36 78.74,84.33 78.74,81.28 79.76,80.26 U14.25
A03  (via drill 0.61)
  Top 0.254: v77.72,81.28 79.25,79.76 U14.26
  Bottom 0.254: v77.72,81.28 76.71,80.26 62.48,80.26 56.39,86.36 48.77,86.36 43.69,81.28 36.07,81.28 30.99,86.36 16.26,86.36 13.72,83.82 JP9.2
A06  (via drill 0.61)
  Top 0.254: v82.3,74.17 84.84,76.71 U14.19 | U$1.10 U$1.11
  Bottom 0.254: v82.3,74.17 78.23,74.17 73.66,69.6 63.25,69.6 54.61,60.96 44.7,60.96 42.16,58.42 U$1.10
AREF  (via drill 0.61)
  Top 0.254: v82.8,77.22 84.33,77.22 U14.20 | v85.85,80.26 85.34,80.77 85.34,83.82 JP1.P$5
  Bottom 0.254: v85.85,80.26 v82.8,77.22
CAM1
  Top 0.254: R15.1 7.62,18.8 12.7,18.8 Q1.2
  Bottom 0.254: IC2.21 74.68,46.74 19.81,46.74 7.62,34.54 R15.1
CAM2
  Top 0.254: R16.1 20.32,18.8 25.4,18.8 Q2.2
  Bottom 0.254: IC2.22 76.71,46.23 32,46.23 20.32,34.54 R16.1
CAM3
  Top 0.254: R17.1 33.02,18.8 38.1,18.8 Q3.2
  Bottom 0.254: IC2.23 78.74,45.72 42.67,45.72 36.58,39.62 30.48,39.62 29.46,38.61 29.46,35.56 32,35.56 33.02,34.54 R17.1
CAM4  (via drill 0.61)
  Top 0.254: Q4.2 51.82,18.8 45.72,18.8 R18.1 45.72,36.07 v49.78,40.13
  Bottom 0.254: IC2.24 75.69,40.13 v49.78,40.13
CAM5
  Top 0.254: R19.1 58.42,18.8 63.5,18.8 Q5.2 63.5,17.27 76.71,17.27 82.3,22.86 82.3,46.23 84.33,46.23 IC2.25
CAM6
  Top 0.254: Q6.2 76.2,18.8 71.12,18.8 R20.1 71.12,34.54 76.2,39.62 76.2,45.21 77.22,46.23 77.22,52.83 89.41,52.83 IC2.26
CAM7
  Top 0.254: Q7.2 88.9,18.8 83.82,18.8 R21.1 83.82,34.54 82.8,35.56 82.8,45.72 88.9,45.72 IC2.27
CAM8
  Top 0.254: IC2.28 95.5,49.78 95.5,35.56 96.52,34.54 R22.1
  Bottom 0.254: R22.1 96.52,18.8 101.6,18.8 Q8.2
CAM9
  Top 0.254: Q9.2 114.3,18.8 109.22,18.8 R23.1 109.22,34.54 108.2,35.56 108.2,46.74 IC2.1
CAM10  (via drill 0.61)
  Top 0.254: Q10.2 127,18.8 121.92,18.8 R24.1 121.92,34.54 120.9,35.56 120.9,41.15 v108.2,53.85
  Bottom 0.254: IC2.2 98.55,53.85 v108.2,53.85
CAM11
  Top 0.254: IC2.3 107.7,42.16 107.7,19.3 109.73,17.27 134.62,17.27 | 134.62,17.27 139.7,17.27 Q11.2 | 134.62,17.27 R25.1
CAM12
  Bottom 0.254: IC2.4 94.49,52.83 140.72,52.83 154.43,39.12 157.99,39.12 158.5,38.61 158.5,35.56 152.4,35.56 | 152.4,35.56 148.34,35.56 147.32,34.54 R26.1 | 152.4,35.56 Q12.2
D02  (via drill 0.61)
  Top 0.254: v74.68,76.2 76.2,76.2 U14.32
  Bottom 0.254: v74.68,76.2 74.17,75.69 70.61,75.69 68.07,73.15 61.47,73.15 57.4,69.09 R30.2
D03  (via drill 0.61)
  Top 0.254: v72.64,76.71 75.18,74.17 76.2,74.17 U14.1
  Bottom 0.254: v72.64,76.71 72.14,76.2 70.1,76.2 67.56,73.66 59.94,73.66 56.39,70.1 45.72,70.1 44.7,69.09 R32.2
D04  (via drill 0.61)
  Top 0.254: v75.18,72.64 76.2,72.64 76.71,73.15 U14.2
  Bottom 0.254: v75.18,72.64 72.64,70.1 59.94,70.1 57.91,68.07 37.08,68.07 35.05,70.1 33.02,70.1 32,69.09 R34.2
D05  (via drill 0.61)
  Top 0.254: v85.34,56.39 85.34,67.06 82.8,69.6 U14.9
  Bottom 0.254: v85.34,56.39 84.84,55.88 37.59,55.88 35.56,57.91 35.56,68.07 20.32,68.07 19.3,69.09 R36.2
D6
  Top 0.254: JP3.1 157.48,58.42 153.92,58.42 153.42,58.93 153.42,60.45 91.44,60.45 87.88,64.01 87.88,65.53 83.31,70.1 U14.10
D7  (via drill 0.61)
  Top 0.254: v88.9,64.52 88.9,65.53 83.82,70.61 U14.11
  Bottom 0.254: v88.9,64.52 88.9,60.96 156.46,60.96 157.48,59.94 JP3.2
D8
  Top 0.254: JP3.3 157.48,60.96 91.95,60.96 89.92,62.99 89.92,65.53 84.33,71.12 U14.12
D9
  Top 0.254: JP3.4 157.48,66.04 129.03,66.04 127.51,67.56 89.41,67.56 84.84,72.14 U14.13
D11  (via drill 0.61)
  Top 0.254: v86.87,72.14 85.85,73.15 U14.15
  Bottom 0.254: v86.87,72.14 94.49,79.76 96.01,79.76 97.54,81.28 J1.4
D12
  Top 0.254: U14.16 86.36,74.17 99.06,74.17 99.06,82.8 100.08,83.82 J1.1
D13
  Top 0.254: U14.17 86.36,76.2 93.98,83.82 93.98,84.84 94.49,85.34 97.54,85.34 97.54,83.82 J1.3
DTR
  Top 0.254: JP1.P$1 C6.1
GND  (via drill 0.6)
  Top 0.305: U14.21 84.03,78.44 84.58,78.99 84.58,79.25 82.04,81.79 v82.04,82.04 | U14.5 78.53,71.67 79.25,72.39 79.25,74.93 v78.99,75.18
  Bottom 0.305: v82.04,82.04 87.63,82.04 JP1.P$6 | v78.99,75.18 71.81,75.18 S13.1
  pour Bottom: 0,88.9 165.1,88.9 165.1,0 0,0
  pour Top: 0,88.9 165.1,88.9 165.1,0 0,0
N$1
  Top 0.254: 13.72,22.35 11.68,20.32 Q1.1 | 13.72,22.35 13.72,44.2 LED1.K | 13.72,22.35 17.78,18.29 17.78,5.59 12.7,5.59 U2.SHIELD
N$2
  Top 0.254: R1.1 11.18,41.66 11.18,44.2 LED1.A
N$3
  Top 0.254: 26.42,22.35 24.38,20.32 Q2.1 | 26.42,22.35 26.42,44.2 LED2.K | 26.42,22.35 30.48,18.29 30.48,5.59 25.4,5.59 U3.SHIELD
N$4
  Top 0.254: R2.1 23.88,41.66 23.88,44.2 LED2.A
N$5
  Top 0.254: 39.12,22.35 37.08,20.32 Q3.1 | 39.12,22.35 39.12,44.2 LED3.K | 39.12,22.35 43.18,18.29 43.18,5.59 38.1,5.59 U4.SHIELD
N$6
  Top 0.254: R3.1 36.58,41.66 36.58,44.2 LED3.A
N$7
  Top 0.254: 51.31,20.83 51.82,21.34 51.82,44.2 LED4.K | 51.31,20.83 Q4.1 | 51.31,20.83 55.88,16.26 55.88,5.59 50.8,5.59 U5.SHIELD
N$8
  Top 0.254: R4.1 49.28,41.66 49.28,44.2 LED4.A
N$9
  Top 0.254: Q5.1 62.48,20.32 64.52,22.35 64.52,44.2 LED5.K
  Bottom 0.254: Q5.1 58.42,20.32 58.42,9.14 61.98,5.59 63.5,5.59 U6.SHIELD
N$10
  Top 0.254: R5.1 61.98,41.66 61.98,44.2 LED5.A
N$11
  Top 0.254: Q6.1 75.18,20.32 77.22,22.35 77.22,44.2 LED6.K
  Bottom 0.254: Q6.1 71.12,20.32 71.12,9.14 74.68,5.59 76.2,5.59 U7.SHIELD
N$12
  Top 0.254: R6.1 74.68,41.66 74.68,44.2 LED6.A
N$13
  Top 0.254: 89.92,22.35 87.88,20.32 Q7.1 | 89.92,22.35 89.92,44.2 LED7.K | 89.92,22.35 93.98,18.29 93.98,5.59 88.9,5.59 U8.SHIELD
N$14
  Top 0.254: R7.1 87.38,41.66 87.38,44.2 LED7.A
N$15
  Top 0.254: LED8.K 102.62,44.2 102.62,22.35 100.58,20.32 Q8.1 100.08,20.32 96.52,16.76 96.52,5.59 101.6,5.59 U9.SHIELD
N$16
  Top 0.254: R8.1 100.08,41.66 100.08,44.2 LED8.A
N$17
  Top 0.254: Q9.1 113.28,20.32 115.32,22.35 115.32,44.2 LED9.K
  Bottom 0.254: Q9.1 109.22,20.32 109.22,9.14 112.78,5.59 114.3,5.59 U10.SHIELD
N$18
  Top 0.254: R9.1 112.78,41.66 112.78,44.2 LED9.A
N$19
  Top 0.254: Q10.1 125.98,20.32 128.02,22.35 128.02,44.2 LED10.K
  Bottom 0.254: Q10.1 121.92,20.32 121.92,9.14 125.48,5.59 127,5.59 U11.SHIELD
N$20
  Top 0.254: R10.1 125.48,41.66 125.48,44.2 LED10.A
N$21
  Top 0.254: 140.72,22.35 138.68,20.32 Q11.1 | 140.72,22.35 140.72,44.2 LED11.K | 140.72,22.35 144.78,18.29 144.78,5.59 139.7,5.59 U12.SHIELD
N$22
  Top 0.254: R11.1 138.18,41.66 138.18,44.2 LED11.A
N$23
  Top 0.254: LED12.K 153.42,44.2 153.42,22.35 151.38,20.32 Q12.1 150.88,20.32 147.32,16.76 147.32,5.59 152.4,5.59 U13.SHIELD
N$24
  Top 0.254: R12.1 150.88,41.66 150.88,44.2 LED12.A
N$25
  Top 0.254: R31.1 R30.1 46.99,70.36 53.85,77.22 Q13.2
N$26
  Top 1.27: J2.PWR 137.07,77.56 D1.C | C3.+ 135.89,72.39 D1.C | IC1.1 135.89,81.28 D1.C
N$27
  Top 0.254: R33.1 R32.1 34.29,70.36 41.15,77.22 Q14.2
N$28
  Top 0.254: LED14.K 50.8,78.74 | 50.8,78.74 Q13.1 | 50.8,78.74 JP6.3
N$29
  Top 0.254: LED15.K 38.1,78.74 | 38.1,78.74 Q14.1 | 38.1,78.74 JP7.3
N$30
  Top 0.254: Y1.2 78.74,69.6 79.25,70.1 U14.7
  Bottom 0.254: C1.2 72.64,66.04 73.66,65.02 78.74,65.02 Y1.2
N$31
  Top 0.254: Y1.1 83.82,66.04 80.26,69.6 U14.8
  Bottom 0.254: C2.2 90.93,65.53 84.33,65.53 83.82,65.02 Y1.1
N$32
  Bottom 0.254: R14.1 114.3,83.82 LED13.A
N$33
  Bottom 0.254: JP5.2 34.04,55.88 39.12,50.8 U$1.6
N$34
  Bottom 0.254: U$1.8 44.7,50.8 45.72,49.78 50.8,49.78 R29.2
N$35
  Bottom 0.254: R15.2 17.78,25.91 16.26,25.91 S1.1
N$36
  Bottom 0.254: R16.2 30.48,25.91 28.96,25.91 S2.1
N$37  (via drill 3.2 pad 6.45)
  other vias: 5.08,83.82
N$38  (via drill 3.2 pad 6.45)
  other vias: 5.08,5.08
N$39  (via drill 3.2 pad 6.45)
  other vias: 160.02,5.08
N$40  (via drill 3.2 pad 6.45)
  other vias: 160.02,83.82
N$41
  Bottom 0.254: R17.2 43.18,25.91 41.66,25.91 S3.1
N$42
  Bottom 0.254: R18.2 55.88,25.91 54.36,25.91 S4.1
N$43
  Bottom 0.254: R19.2 68.58,25.91 67.06,25.91 S5.1
N$44
  Bottom 0.254: R20.2 81.28,25.91 79.76,25.91 S6.1
N$45
  Bottom 0.254: R21.2 93.98,25.91 92.46,25.91 S7.1
N$46
  Bottom 0.254: R22.2 106.68,25.91 105.16,25.91 S8.1
N$47
  Bottom 0.254: R23.2 119.38,25.91 117.86,25.91 S9.1
N$48
  Bottom 0.254: R24.2 132.08,25.91 130.56,25.91 S10.1
N$49
  Bottom 0.254: R25.2 144.78,25.91 143.26,25.91 S11.1
N$50
  Bottom 0.254: R26.2 157.48,25.91 155.96,25.91 S12.1
N$51
  Top 0.254: U$1.4 34.04,50.8 29.46,55.37 29.46,58.42 U$1.15
N$52
  Bottom 0.254: JP5.1 6.1,57.4 35.05,57.4 41.66,50.8 U$1.7
N$53
  Bottom 0.254: U$1.9 44.7,58.42 45.72,59.44 50.8,59.44 R29.1
N$54
  Top 0.254: R35.1 R34.1 21.59,70.36 28.45,77.22 Q15.2
N$55
  Top 0.254: LED16.K 25.4,78.74 | 25.4,78.74 Q15.1 | 25.4,78.74 JP8.3
N$56
  Top 0.254: R37.1 R36.1 8.89,70.36 15.75,77.22 Q16.2
N$57
  Top 0.254: 11.68,78.74 Q16.1 | 11.68,78.74 11.68,83.82 JP9.3 | 11.68,78.74 LED17.K
N$58
  Top 0.254: R38.2 49.28,74.68 49.28,76.2 LED14.A
N$59
  Top 0.254: R39.2 36.58,74.68 36.58,76.2 LED15.A
N$60
  Top 0.254: R40.2 23.88,74.68 23.88,76.2 LED16.A
N$62
  Top 0.254: R41.2 11.18,74.68 11.18,76.2 LED17.A
RST  (via drill 0.61)
  Top 0.254: C6.2 67.56,79.76 67.56,78.74 | 67.56,78.74 67.56,76.2 S13.3 | v76.71,78.74 77.72,77.72 U14.29 | R13.2 67.56,78.74
  Bottom 0.254: R13.2 v76.71,78.74 79.25,81.28 92.46,81.28 95,83.82 J1.5
RXI  (via drill 0.61)
  Top 0.254: v75.69,81.28 75.69,77.72 76.71,77.72 77.22,77.22 U14.30
  Bottom 0.254: v75.69,81.28 76.71,82.3 78.23,82.3 79.76,83.82 JP1.P$3
SCL  (via drill 0.61)
  Top 0.254: v79.25,76.71 79.25,77.72 78.74,78.23 U14.28
  Bottom 0.254: v79.25,76.71 80.77,75.18 82.8,75.18 83.31,74.68 83.31,73.15 81.28,73.15 80.77,73.66 78.74,73.66 72.64,67.56 72.14,67.56 68.58,64.01 68.58,60.45 | IC2.12 68.58,60.45 | 68.58,60.45 58.93,60.45 58.42,59.94 R27.1
SDA  (via drill 0.61)
  Top 0.254: v80.26,72.64 80.26,77.72 79.25,78.74 U14.27
  Bottom 0.254: v80.26,72.64 80.26,56.39 68.07,56.39 | IC2.13 68.07,56.39 | R28.1 57.91,56.39 68.07,56.39
TXO
  Top 0.254: U14.31 76.71,76.71 76.2,77.22 74.68,77.22 74.68,81.79 75.18,82.3 77.22,82.3 77.22,83.82 JP1.P$2

### Text on the board
tPlace: GND | S04 | +5V | GND | S03 | +5V | GND | S02 | +5V | GND | S01 | +5V | 7805 | 0.1uF | RST | SCK | MISO | LED17 | C6 | 1k | R14 | 2N3904 | LED16 | 2N3904 | LED15 | 2N3904 | LED14 | 2N3904 | LED13 | D1 | GND | MOSI | +5V | 1N4001 | Q16 | Q15 | Q14 | Q13 | ATMEGA328 | C3 | R13 | C5 | C4 | 220 | 220 | 220 | 220 | 10k | R36 | R34 | R32 | R30 | 1k | 1k | 1k | 1k | 0.1uF | R41 | R40 | R39 | R38 | GND | GPIO | +5V | 10uF | 10k | 10k | 10k | 10k | 100uF | D06 | R37 | R35 | R33 | R31 | 16MHz | C1 | 22pF | C2 | 22pF | D07 | D08 | S- | Abbott Camera Controller | March 2014 | D09 | S+ | R29 | R28 | R27 | INA125P | 10 | MCP23017SP | Version 01 | E- | 4k7 | 4k7 | E+ | LOAD CELL | LED1 | LED2 | LED3 | LED4 | LED5 | LED6 | LED7 | LED8 | LED9 | LED10 | LED11 | LED12 | R1 | R2 | R3 | R4 | R5 | R6 | R7 | R8 | R9 | R10 | R11 | R12 | 220 | 220 | 220 | 220 | 220 | 220 | 220 | 220 | 220 | 220 | 220 | R15 | R16 | R17 | R18 | R19 | R20 | R21 | R22 | R23 | R24 | R25 | R26 | 1k | 1k | 1k | 1k | 1k | 1k | 1k | 1k | 1k | 1k | 1k | 1k | 2N3904 | 2N3904 | 2N3904 | 2N3904 | 2N3904 | 2N3904 | 2N3904 | 2N3904 | 2N3904 | 2N3904 | 2N3904 | 2N3904 | Q1 | Q2 | Q3 | Q4 | Q5 | Q6 | Q7 | Q8 | Q9 | Q10 | Q11 | Q12